# Altium schematic sheet SCH_MATIASALFARO_PROYECTOFINAL.SchDoc
size A3
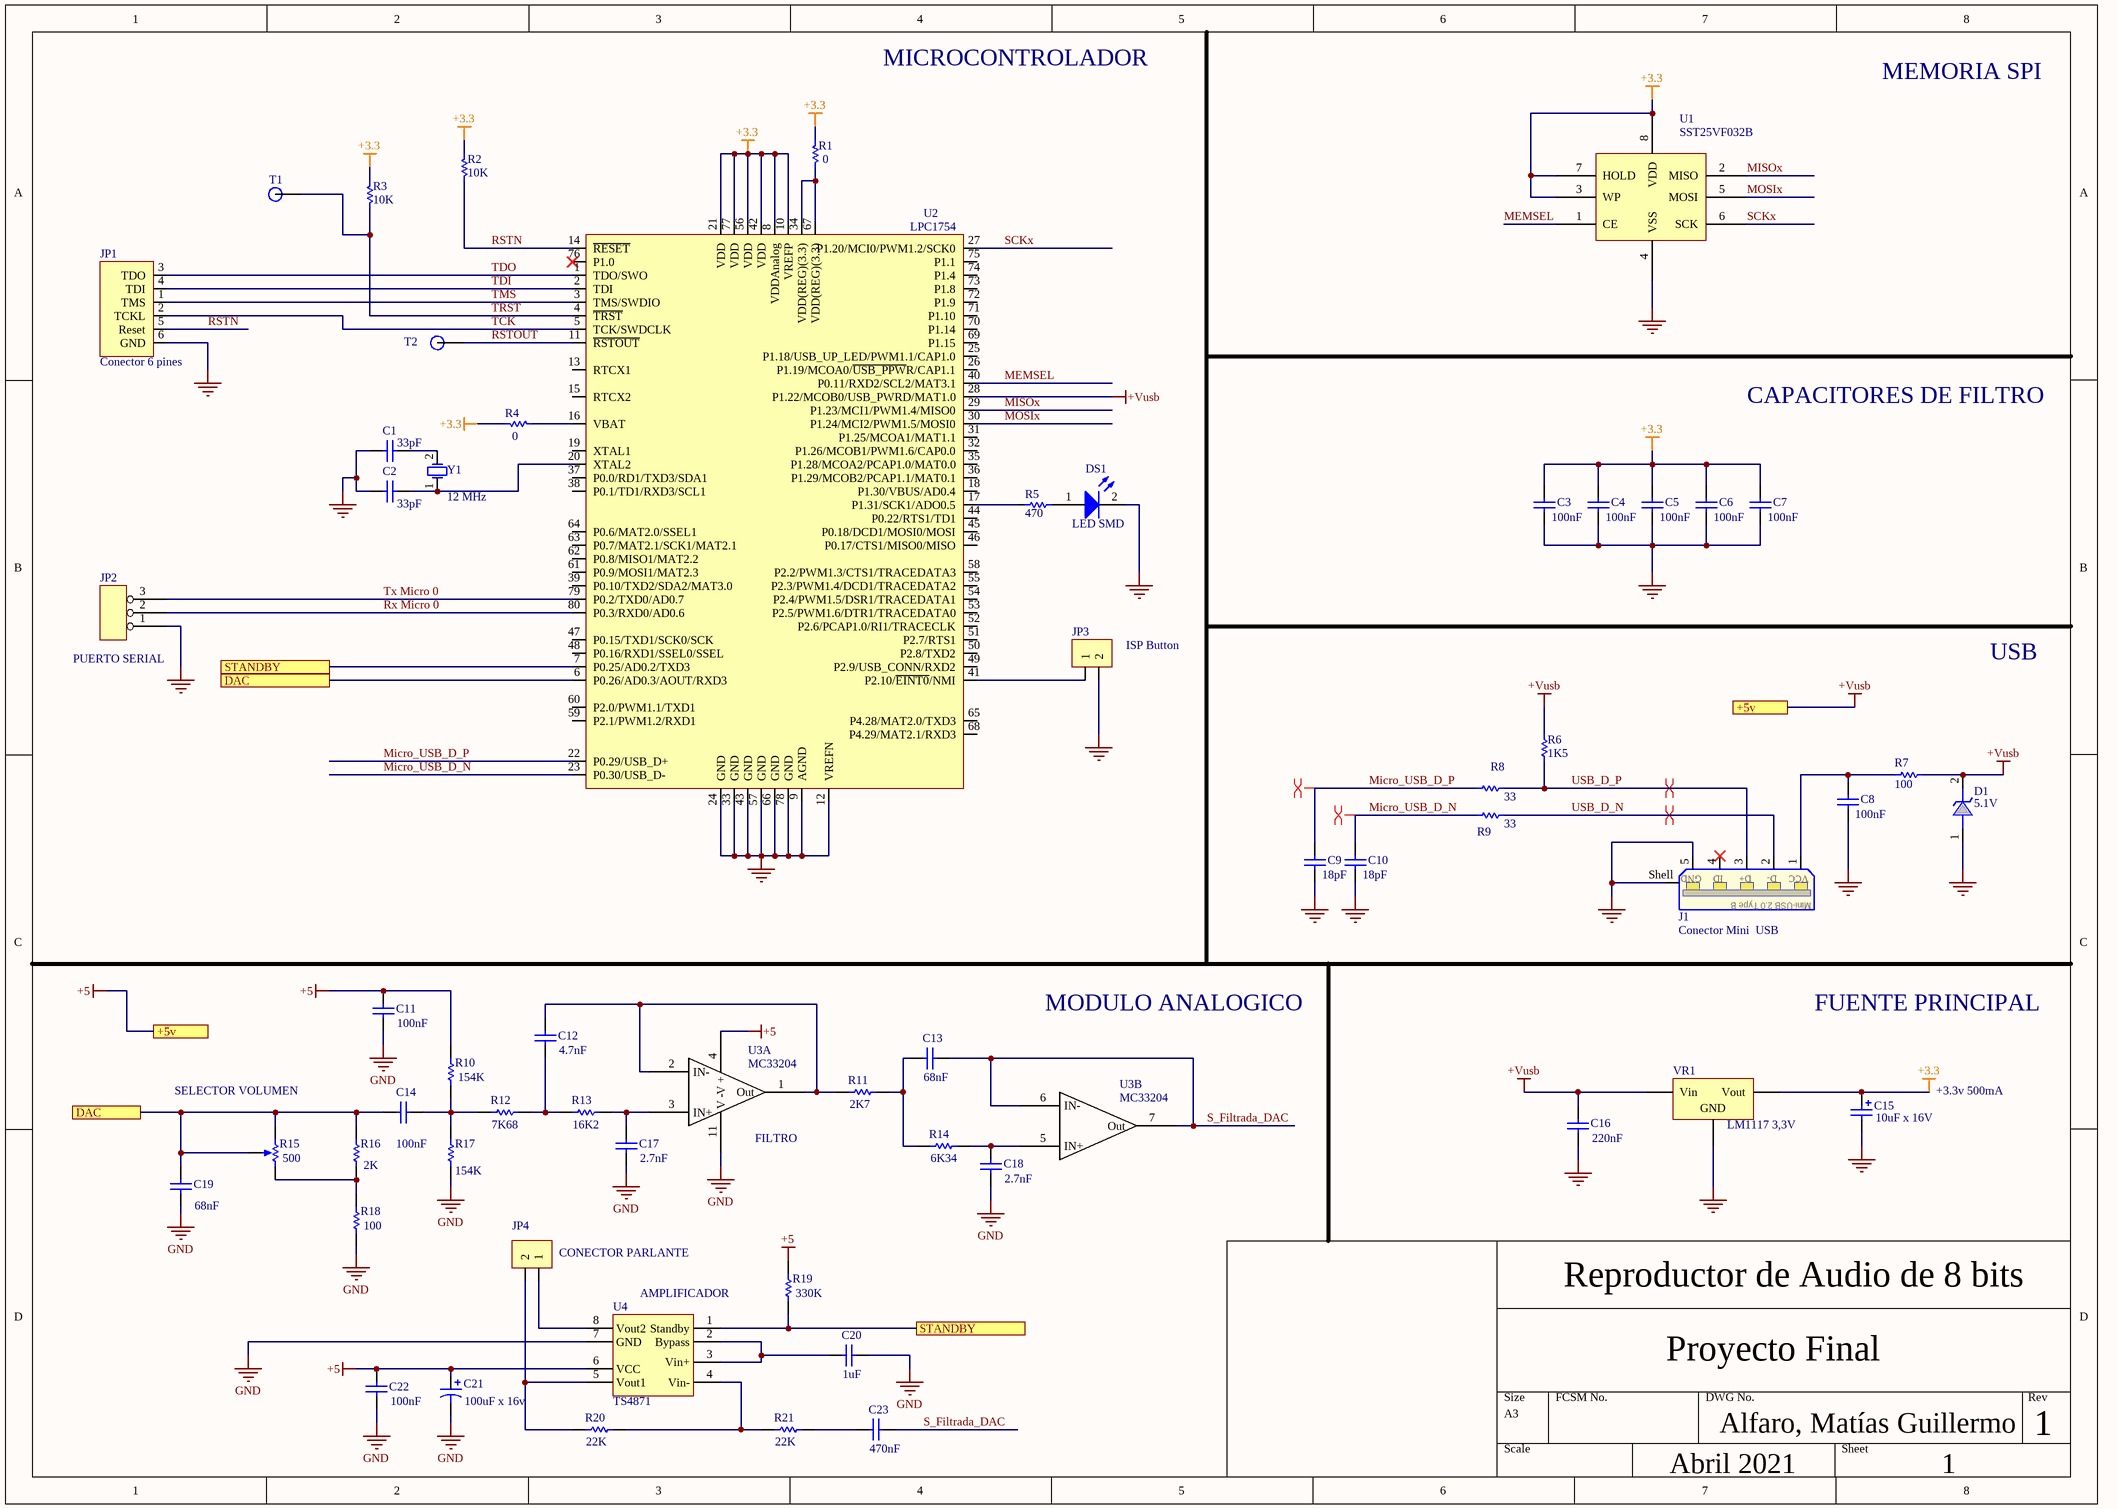
[diagram p0: SCH_MATIASALFARO_PROYECTOFINAL.SchDoc]

## Parts
C1  value 33pF  [C 0805]  (hidden comment: Cap 33pF)
C2  value 33pF  [C 0805]  (hidden comment: Cap 33pF)
C3  value 100nF  [C 0805]  (hidden comment: Cap 100nF)
C4  value 100nF  [C 0805]  (hidden comment: Cap 100nF)
C5  value 100nF  [C 0805]  (hidden comment: Cap 100nF)
C6  value 100nF  [C 0805]  (hidden comment: Cap 100nF)
C7  value 100nF  [C 0805]  (hidden comment: Cap 100nF)
C8  value 100nF  [C 0805]  (hidden comment: Cap 100nF)
C9  value 18pF  [C 0805]  (hidden comment: Cap 18pF)
C10  value 18pF  [C 0805]  (hidden comment: Cap 18pF)
C11  value 100nF  [C 0805]  (hidden comment: Cap 100nF)
C12  value 4.7nF  [C 0805]  (hidden comment: Cap 4.7nF)
C13  value 68nF  [C 0805]  (hidden comment: Cap 68nF)
C14  value 100nF  [C 0805]  (hidden comment: Cap 100nF)
C15  value 10uF x 16V  [c 0805 Tantalio]  (hidden comment: Cap 10uF x 16V)
C16  value 220nF  [C 0805]  (hidden comment: Cap 220nF)
C17  value 2.7nF  [C 0805]  (hidden comment: Cap 2.7nF)
C18  value 2.7nF  [C 0805]  (hidden comment: Cap 2.7nF)
C19  value 68nF  [C 0805]  (hidden comment: Cap 68nF)
C20  value 1uF  [C 0805]  (hidden comment: Cap 1uF)
C21  value 100uF x 16v  [c 0805 Tantalio]  (hidden comment: Cap 100uF x 16v)
C22  value 100nF  [C 0805]  (hidden comment: Cap 100nF)
C23  value 470nF  [C 0805]  (hidden comment: Cap 470nF)
D1  5.1V  [DIODE_SMC]
DS1  LED SMD  [LED 1206 RED]
J1  Conector Mini  USB  [Mini USB Hembra 90º DIP]
JP1  Conector 6 pines  [Bornera 6 (2.54mm)]
JP2  PUERTO SERIAL  [Bornera 3 (5mm)]
JP3  Pines M. a 90º + Jumper  [Bornera 2 (2.54mm)]  (value not drawn)
JP4  Pines M. a 90º + Jumper  [Bornera 2 (2.54mm)]  (value not drawn)
R1  value 0  [R 0805]  (hidden comment: Res 0)
R2  value 10K  [R 0805]  (hidden comment: Res 10K)
R3  value 10K  [R 0805]  (hidden comment: Res 10K)
R4  value 0  [R 0805]  (hidden comment: Res 0)
R5  value 470  [R 0805]  (hidden comment: Res 470)
R6  value 1K5  [R 0805]  (hidden comment: Res 1K5)
R7  value 100  [R 0805]  (hidden comment: Res 100)
R8  value 33  [R 0805]  (hidden comment: Res 33)
R9  value 33  [R 0805]  (hidden comment: Res 33)
R10  value 154K  [R 0805]  (hidden comment: Res 154K)
R11  value 2K7  [R 0805]  (hidden comment: Res 2K7)
R12  value 7K68  [R 0805]  (hidden comment: Res 7K68)
R13  value 16K2  [R 0805]  (hidden comment: Res 16K2)
R14  value 6K34  [R 0805]  (hidden comment: Res 6K34)
R15  value 500  [VR5]  (hidden comment: RPot 500)
R16  value 2K  [R 0805]  (hidden comment: Res 2K)
R17  value 154K  [R 0805]  (hidden comment: Res 154K)
R18  value 100  [R 0805]  (hidden comment: Res 100)
R19  value 330K  [R 0805]  (hidden comment: Res 330K)
R20  value 22K  [R 0805]  (hidden comment: Res 22K)
R21  value 22K  [R 0805]  (hidden comment: Res 22K)
T1  Test Point  [TestPoint Keystone 5000 Silver-Red]  (value not drawn)
T2  Test Point  [TestPoint Keystone 5000 Silver-Red]  (value not drawn)
U1  SST25VF032B  [SO8_L]
U2  LPC1754  [LQFP80]
U3  MC33204  [D014_M]  (parts A,B of 4)
U4  TS4871  [SO8_M]
VR1  LM1117 3,3V  [SOT223_L]
Y1  12 MHz  [Cristal]

## Ports
+5v, DAC, STANDBY

## Nets
+3.3: C3.2 C4.2 C5.2 C6.2 C7.2 C15.1 R1.2 R2.2 R3.2 R4.2 U1.3(WP) U1.7(HOLD) U1.8(VDD) U2.8(VDDAnalog) U2.10(VREFP) U2.21(VDD) U2.42(VDD) U2.56(VDD) U2.77(VDD) VR1.3(Vout)
+5: C11.1 C16.1 C21.1 C22.2 D1.2(CATHODE) R6.2 R7.1 R10.2 R19.1 U2.28(P1.22/MCOB0/USB_PWRD/MAT1.0) U3.4(V_+) U4.6(VCC) VR1.1(Vin) ; port +5v  [also labelled +Vusb]
GND: C1.1 C2.1 C3.1 C4.1 C5.1 C6.1 C7.1 C8.1 C9.1 C10.1 C11.2 C15.2 C16.2 C17.2 C18.1 C19.1 C20.2 C21.2 C22.1 D1.1(ANODE) DS1.2(K) J1.5(GND) J1.Shell JP1.6(GND) JP2.1 JP3.2 R17.1 R18.1 U1.4(VSS) U2.9(AGND) U2.12(VREFN) U2.24(GND) U2.33(GND) U2.43(GND) U2.57(GND) U2.66(GND) U2.78(GND) U3.11(V_-) U4.7(GND) VR1.2(GND)
DAC: C14.1 C19.2 R15.1(TOP) R15.3(TAP) R16.2 U2.6(P0.26/AD0.3/AOUT/RXD3) ; port DAC
MEMSEL: U1.1(CE) U2.40(P0.11/RXD2/SCL2/MAT3.1)
Micro_USB_D_N: C10.2 R9.2 U2.23(P0.30/USB_D-)
Micro_USB_D_P: C9.2 R8.2 U2.22(P0.29/USB_D+)
MISOx: U1.2(MISO) U2.29(P1.23/MCI1/PWM1.4/MISO0)
MOSIx: U1.5(MOSI) U2.30(P1.24/MCI2/PWM1.5/MOSI0)
RSTN: JP1.5(Reset) R2.1 U2.14(~{RESET})
RSTOUT: T2.1 U2.11(~{RSTOUT})
Rx Micro 0: JP2.2 U2.80(P0.3/RXD0/AD0.6)
S_Filtrada_DAC: C13.2 C23.2 U3.6(IN-) U3.7(Out)
SCKx: U1.6(SCK) U2.27(P1.20/MCI0/PWM1.2/SCK0)
STANDBY: R19.2 U2.7(P0.25/AD0.2/TXD3) U4.1(Standby) ; port STANDBY
TCK: JP1.2(TCKL) U2.5(TCK/SWDCLK)
TDI: JP1.4(TDI) U2.2(TDI)
TDO: JP1.3(TDO) U2.1(TDO/SWO)
TMS: JP1.1(TMS) U2.3(TMS/SWDIO)
TRST: R3.1 T1.1 U2.4(~{TRST})
Tx Micro 0: JP2.3 U2.79(P0.2/TXD0/AD0.7)
USB_D_N: J1.2(D-) R9.1
USB_D_P: J1.3(D+) R6.1 R8.1
NetC1_2: C1.2 Y1.2(OSC2)
NetC2_2: C2.2 U2.20(XTAL2) Y1.1(OSC1)
NetC8_2: C8.2 J1.1(VCC) R7.2
NetC12_1: C12.1 R11.2 U3.1(Out) U3.2(IN-)
NetC12_2: C12.2 R12.1 R13.2
NetC13_1: C13.1 R11.1 R14.2
NetC14_2: C14.2 R10.1 R12.2 R17.2
NetC17_1: C17.1 R13.1 U3.3(IN+)
NetC18_2: C18.2 R14.1 U3.5(IN+)
NetC20_1: C20.1 U4.2(Bypass) U4.3(Vin+)
NetC23_1: C23.1 R21.1
NetDS1_1: DS1.1(A) R5.1
NetJP3_1: JP3.1 U2.41(P2.10/~{EINT0}/NMI)
NetJP4_1: JP4.1 U4.8(Vout2)
NetJP4_2: JP4.2 R20.2 U4.5(Vout1)
NetR1_1: R1.1 U2.34(VDD(REG)(3.3)) U2.67(VDD(REG)(3.3))
NetR4_1: R4.1 U2.16(VBAT)
NetR5_2: R5.2 U2.17(P1.31/SCK1/ADO0.5)
NetR15_2: R15.2(BOT) R16.1 R18.2
NetR20_1: R20.1 R21.2 U4.4(Vin-)

Not connected (* = marked no-connect by the designer): J1 4(ID)*; U2 13(RTCX1) 15(RTCX2) 18(P1.30/VBUS/AD0.4) 19(XTAL1) 25(P1.18/USB_UP_LED/PWM1.1/CAP1.0) 26(P1.19/MCOA0/~{USB_PPW}R/CAP1.1) 31(P1.25/MCOA1/MAT1.1) 32(P1.26/MCOB1/PWM1.6/CAP0.0) 35(P1.28/MCOA2/PCAP1.0/MAT0.0) 36(P1.29/MCOB2/PCAP1.1/MAT0.1) 37(P0.0/RD1/TXD3/SDA1) 38(P0.1/TD1/RXD3/SCL1) 39(P0.10/TXD2/SDA2/MAT3.0) 44(P0.22/RTS1/TD1) 45(P0.18/DCD1/MOSI0/MOSI) 46(P0.17/CTS1/MISO0/MISO) 47(P0.15/TXD1/SCK0/SCK) 48(P0.16/RXD1/SSEL0/SSEL) 49(P2.9/USB_CONN/RXD2) 50(P2.8/TXD2) 51(P2.7/RTS1) 52(P2.6/PCAP1.0/RI1/TRACECLK) 53(P2.5/PWM1.6/DTR1/TRACEDATA0) 54(P2.4/PWM1.5/DSR1/TRACEDATA1) 55(P2.3/PWM1.4/DCD1/TRACEDATA2) 58(P2.2/PWM1.3/CTS1/TRACEDATA3) 59(P2.1/PWM1.2/RXD1) 60(P2.0/PWM1.1/TXD1) 61(P0.9/MOSI1/MAT2.3) 62(P0.8/MISO1/MAT2.2) 63(P0.7/MAT2.1/SCK1/MAT2.1) 64(P0.6/MAT2.0/SSEL1) 65(P4.28/MAT2.0/TXD3) 68(P4.29/MAT2.1/RXD3) 69(P1.15) 70(P1.14) 71(P1.10) 72(P1.9) 73(P1.8) 74(P1.4) 75(P1.1) 76(P1.0)*

## Layout directives
differential pair: Micro_USB_D_N, Micro_USB_D_P, USB_D_N, USB_D_P

## Notes on the sheet
- MICROCONTROLADOR
- MEMORIA SPI
- CAPACITORES DE FILTRO
- (near JP3) ISP Button
- USB
- MODULO ANALOGICO
- FUENTE PRINCIPAL
- (near R15) SELECTOR VOLUMEN
- +3.3v 500mA
- (near U3) FILTRO
- (near JP4) CONECTOR PARLANTE
- (near U4) AMPLIFICADOR
- Reproductor de Audio de 8 bits
- Proyecto Final
- Abril 2021
- Alfaro, Matías Guillermo
- 1
- (in symbol 651005136421) Mini-USB 2.0 Type B

## Library data of the parts
C1-C14 C16-C20 C22 C23 = Cap: Capacitor; Published: 8-Jun-2000; LatestRevisionDate: 17-Jul-2002; LatestRevisionNote: Re-released for DXP Platform.; PackageReference: RAD-0.3; Publisher: Altium Limited; PackageDescription: Radial Cap, Thru-Hole; 2 Leads; 0.3 in Pin Spacing
C15 = Cap Pol1: Capacitor Electrolitico; Manufacturer: Generic Components; Class I: Passive; Published: 8-Jun-2000; Revision: July-2002: Re-released for DXP Platform.; Publisher: Altium Limited; Class II: Capacitor
C21 = Cap Pol1: Polarized Capacitor (Radial); Published: 8-Jun-2000; LatestRevisionDate: 17-Jul-2002; LatestRevisionNote: Re-released for DXP Platform.; PackageReference: RB7.6-15; Publisher: Altium Limited; PackageDescription: Polarized Capacitor (Radial); 2 Leads
D1 = DIODE ZENER1: Diodo Zener; pin to pad: 1>2 2>1; Text Field1: 30; Text Field2: 20
DS1 = LED1: Led Color Verde; Manufacturer: Generic Components; Class I: Optoelectronic; Published: 8-Jun-2000; Revision: July-2002: Re-released for DXP Platform.; Publisher: Altium Limited; Class II: LED
J1 = 651005136421: WR-COM Mini USB 2.0 Type B Vertical 5 Contacts; Published: June 2016; Publisher: Wurth Elektronik; ComponentLink1Description: Manufacturer; ComponentLink1URL: http://www.we-online.de; ComponentLink2Description: Datasheet; ComponentLink2URL: http://katalog.we-online.de/em/datasheet/651005136421.pdf; PartNumber: 651005136421
JP1 = Header 6: Conector Hembra 90º; Manufacturer: Generic Components; Class: Connector
JP2 = HEADER 3: PINES; Text Field1: 0,009
JP3 JP4 = ConectorX2: Pines Macho; Text Field1: 20; Text Field2: 40
R1-R9 = Res1: Resistencia; Manufacturer: Generic Components; Class I: Passive; Class II: Resistor; Published: 8-Jun-2000; Revision: July-2002: Re-released for DXP Platform.; Publisher: Altium Limited
R10-R14 R16-R21 = Res1: Resistor; Published: 8-Jun-2000; LatestRevisionDate: 17-Jul-2002; LatestRevisionNote: Re-released for DXP Platform.; PackageReference: AXIAL-0.3; Publisher: Altium Limited; PackageDescription: Axial Device, Thru-Hole; 2 Leads; 0.3 in Pin Spacing
R15 = RPot: Potentiometer; Sim Note: Enter the Resistance value and the set point into parameter fields.; Set Position: 0.5; Published: 8-Jun-2000; LatestRevisionDate: 17-Jul-2002; LatestRevisionNote: Re-released for DXP Platform.; PackageReference: VR5; Publisher: Altium Limited; PackageDescription: Variable Resistor, Thru-Hole; 3 Leads
T1 T2 = UNIPIN
U2 = LPC1754: Microcontrolador LPC1754
U3 = MC33204: 4 x Amplificador Operacional
VR1 = Volt Reg: Voltage Regulator; Published: 24-Mar-1999; LatestRevisionDate: 29-May-2009; LatestRevisionNote: IPC-7351 Footprint Added.; PackageReference: D2PAK; Publisher: Altium Limited; PackageDescription: 3-Pin Transistor Outline Package 2.54 mm Pitch, 15.1 mm Lead Span
Y1 = XTAL: Cristal; Manufacturer: Generic Components; Class I: Oscillator; Class II: Crystal Oscillator; Published: 8-Jun-2000; Revision: July-2002: Re-released for DXP Platform.; Publisher: Altium Limited